# Altium schematic sheet servo.SchDoc
size A
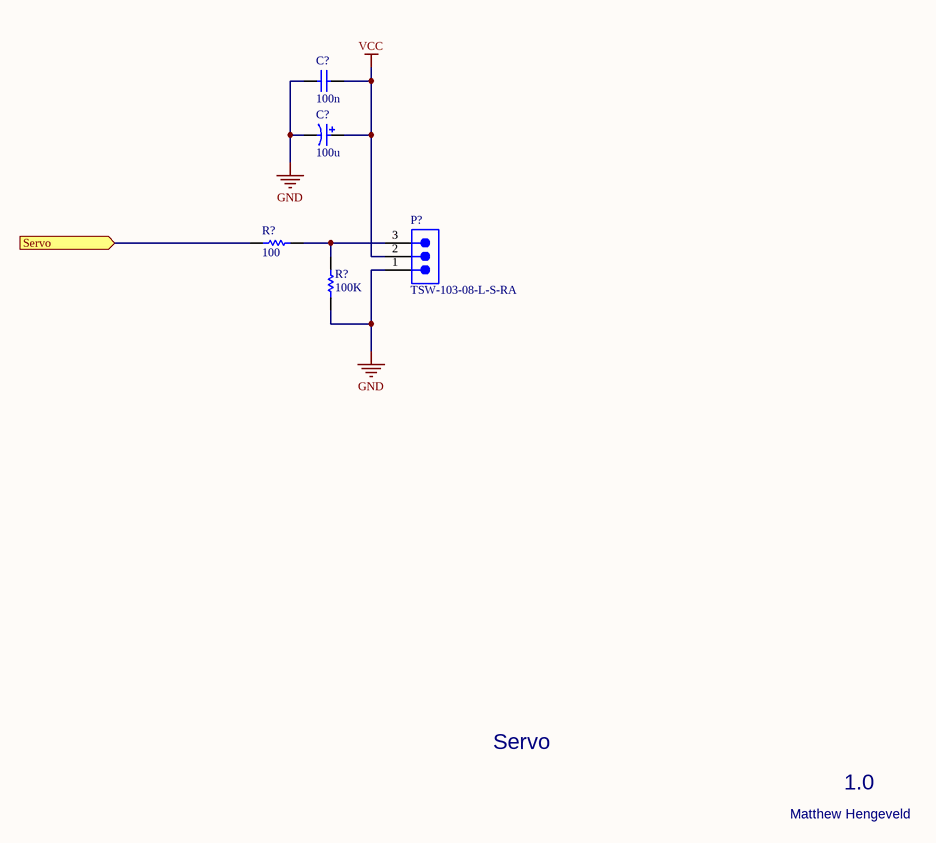
[diagram p0: servo.SchDoc]

## Parts
(Parts that share a designator on the sheet are numbered #1, #2 ... from top to bottom, then left to right.)
C?#1  100n  [CAPC1608X87X35NL15T15]
C?#2  100u  [NIC-CAPA2-6.3X5.8_V]
P?  TSW-103-08-L-S-RA  [SMTC-TSW-103-08-X-S-RA]
R?#1  100  [RESC1608X55X30ML15T15]
R?#2  100K  [RESC1608X55X30ML15T15]

## Ports
Servo (in)

## Nets
GND: C?#1.2 C?#2.2 P?.1 R?#2.2
VCC: C?#1.1 C?#2.1 P?.2
Servo: R?#1.2 ; port Servo
NetP?_3: P?.3 R?#1.1 R?#2.1

## Notes on the sheet
- Servo
- 1.0
- Matthew Hengeveld

## Library data of the parts
C?#1 = CMP-2006-03300-1: Part Number: C0603X104K5RACTU; Manufacturer: Kemet
C?#2 = CMP-0687-00050-1: Aluminum Electrolytic Capacitor, UD Series, Low Impedance, 100 uF, 16 V, + / - 20%, -55 to 105 degC, Chip Type, 6.3 x 5.8 mm D x L, Pb-Free, Reel; PartNumber: UUD1C101MCL1GS; Manufacturer: Nichicon; Tolerance Rated Capacitance: -20 to 20%; Rated Capacitance: 100 uF; Impedance: 0.44 Ohm; Rated Voltage: 16 V; Endurance Time: 2000 h; Packing: Dia382mm Reel; Rated Ripple Current (at 100kHz): 230 mA; PackageReference: CAPAE-D6.3H5.8; ComponentLink2URL: http://products.nichicon.co.jp/en/pdf/XJA043/e-ud.pdf; ComponentLink3Description: Package Specification; Mounting Technology: Surface Mount; RoHS: TRUE; Diameter: 6.3 mm; Length: 5.8 mm; ComponentLink3URL: http://products.nichicon.co.jp/en/pdf/XJA043/e-ud.pdf; ComponentLink1Description: Manufacturer URL; ComponentLink2Description: Datasheet; PackageDescription: 2-Pin Surface Mount Device, Diameter 6.3 mm, Height 5.8 mm, Pitch 5.4 mm; DatasheetVersion: 08/2012; ComponentLink1URL: http://www.nichicon.co.jp/
P? = CMP-1024-00343-1: 0.025" SQ Post Header, Through-hole, Right Angle, -55 to 125 degC, 2.54 mm Pitch, 3-Pin, Male, RoHS; Manufacturer: Samtec; Pitch: 2.54 mm; ComponentLink2Description: Datasheet; Temperature Range: -55 to 125 degC; ComponentLink1Description: Manufacturer URL; Mounting Technology: Through-hole; ComponentLink3URL: http://www.samtec.com/documents/webfiles/cpdf/TSW-XXX-XX-XXX-X-XX-XXX-MKT.pdf; DatasheetVersion: F-214; PackageDescription: .025[0.64] SQ. Post Terminal Strip Assembly; PackageVersion: DM, 8/1988; Orientation: Right Angle; PackageReference: TSW-103-08-X-S-RA; ComponentLink1URL: http://www.samtec.com; ComponentLink3Description: Package Specification; PartNumber: TSW-103-08-L-S-RA; RoHS: True; ComponentLink2URL: http://www.samtec.com/documents/webfiles/pdf/TSW_TH.PDF
R?#1 R?#2 = CMP-2000-00704-1: Manufacturer: Panasonic; Part Number: ERJ-3GEYJ103V